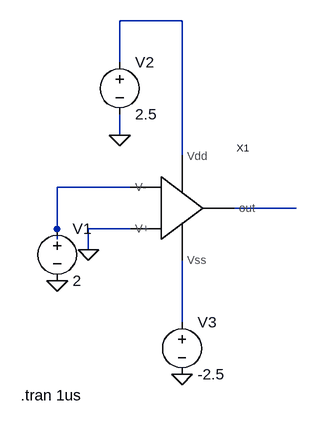
[diagram p0: schematic Draft6.asc]
Draft6.asc, the LTspice schematic file:
Version 4
SHEET 1 880 680
WIRE 272 -160 176 -160
WIRE 176 -96 176 -160
WIRE 176 16 176 -16
WIRE 272 48 272 -160
WIRE 192 96 80 96
WIRE 448 128 352 128
WIRE 80 160 80 96
WIRE 192 160 128 160
WIRE 80 176 80 160
WIRE 128 192 128 160
WIRE 272 304 272 208
FLAG 128 192 0
FLAG 80 240 0
FLAG 176 16 0
FLAG 272 384 0
SYMBOL OPAMP 160 128 R0
SYMATTR InstName X1
SYMBOL voltage 80 144 R0
WINDOW 123 0 0 Left 0
WINDOW 39 0 0 Left 0
SYMATTR InstName V1
SYMATTR Value 2
SYMBOL voltage 176 -112 R0
WINDOW 123 0 0 Left 0
WINDOW 39 0 0 Left 0
SYMATTR InstName V2
SYMATTR Value 2.5
SYMBOL voltage 272 288 R0
WINDOW 123 0 0 Left 0
WINDOW 39 0 0 Left 0
SYMATTR InstName V3
SYMATTR Value -2.5
TEXT 24 416 Left 2 !.tran 1us

The netlist it stands for:
* Draft6.asc
XX1 N001 N004 N002 0 N003 OPAMP  ; pins Vdd Vss V- V+ out
V1 N002 0 2
V2 N001 0 2.5
V3 N004 0 -2.5
.tran 1us
.backanno
.end